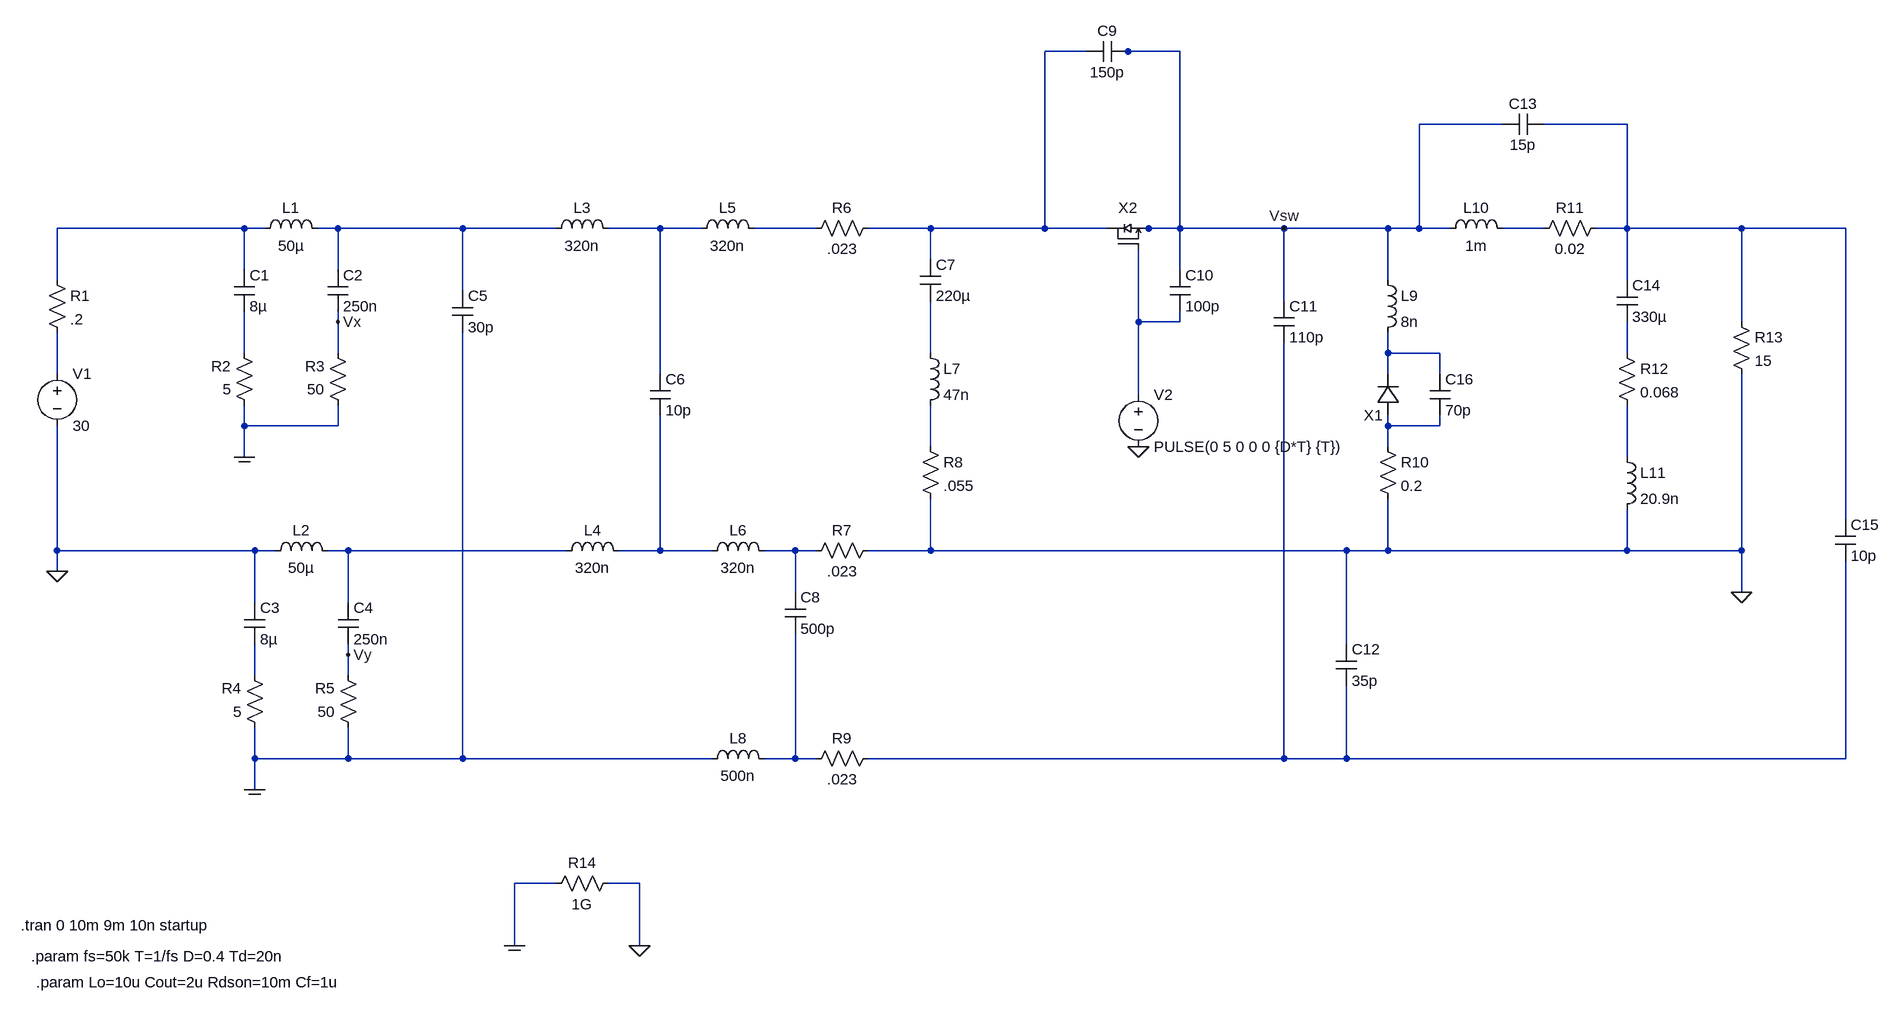
[diagram p0: schematic Buck_EMI.asc]
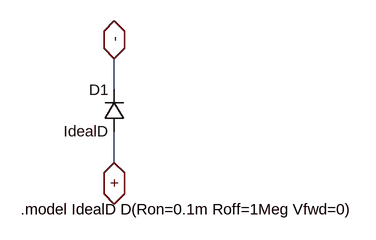
[diagram p1: sub-circuit idealdiode.asc]
Buck_EMI.asc, the LTspice schematic file:
Version 4
SHEET 1 1928 1192
WIRE 704 -256 640 -256
WIRE 768 -256 752 -256
WIRE 848 -256 768 -256
WIRE 1344 -144 1216 -144
WIRE 1536 -144 1408 -144
WIRE -592 16 -880 16
WIRE -560 16 -592 16
WIRE -448 16 -480 16
WIRE -256 16 -448 16
WIRE -112 16 -256 16
WIRE 48 16 -32 16
WIRE 112 16 48 16
WIRE 288 16 192 16
WIRE 464 16 368 16
WIRE 640 16 640 -256
WIRE 640 16 464 16
WIRE 736 16 640 16
WIRE 800 16 784 16
WIRE 848 16 848 -256
WIRE 848 16 800 16
WIRE 1008 16 848 16
WIRE 1168 16 1008 16
WIRE 1216 16 1216 -144
WIRE 1216 16 1168 16
WIRE 1264 16 1216 16
WIRE 1408 16 1344 16
WIRE 1536 16 1536 -144
WIRE 1536 16 1488 16
WIRE 1712 16 1536 16
WIRE 1872 16 1712 16
WIRE 464 64 464 16
WIRE -592 80 -592 16
WIRE -448 80 -448 16
WIRE 848 80 848 16
WIRE -880 96 -880 16
WIRE 1168 96 1168 16
WIRE 1536 96 1536 16
WIRE -256 112 -256 16
WIRE 1008 128 1008 16
WIRE -448 160 -448 144
WIRE 784 160 784 48
WIRE 848 160 848 144
WIRE 848 160 784 160
WIRE 1712 160 1712 16
WIRE -592 208 -592 144
WIRE -448 208 -448 160
WIRE 464 208 464 128
WIRE 1168 208 1168 176
WIRE 1248 208 1168 208
WIRE 1536 208 1536 160
WIRE -880 240 -880 176
WIRE 48 240 48 16
WIRE 1168 240 1168 208
WIRE 1248 240 1248 208
WIRE 784 272 784 160
WIRE -592 320 -592 288
WIRE -448 320 -448 288
WIRE -448 320 -592 320
WIRE 1168 320 1168 304
WIRE 1248 320 1248 304
WIRE 1248 320 1168 320
WIRE 464 352 464 288
WIRE 1168 352 1168 320
WIRE -592 368 -592 320
WIRE 1536 368 1536 288
WIRE 1872 464 1872 16
WIRE -880 512 -880 320
WIRE -576 512 -880 512
WIRE -544 512 -576 512
WIRE -432 512 -464 512
WIRE -96 512 -432 512
WIRE 48 512 48 304
WIRE 48 512 -16 512
WIRE 128 512 48 512
WIRE 256 512 208 512
WIRE 288 512 256 512
WIRE 464 512 464 432
WIRE 464 512 368 512
WIRE 1104 512 464 512
WIRE 1168 512 1168 432
WIRE 1168 512 1104 512
WIRE 1536 512 1536 448
WIRE 1536 512 1168 512
WIRE 1712 512 1712 240
WIRE 1712 512 1536 512
WIRE -880 544 -880 512
WIRE 256 576 256 512
WIRE 1712 576 1712 512
WIRE -576 592 -576 512
WIRE -432 592 -432 512
WIRE 1104 656 1104 512
WIRE -432 672 -432 656
WIRE -576 704 -576 656
WIRE -432 704 -432 672
WIRE -576 832 -576 784
WIRE -432 832 -432 784
WIRE -432 832 -576 832
WIRE -256 832 -256 176
WIRE -256 832 -432 832
WIRE 128 832 -256 832
WIRE 256 832 256 640
WIRE 256 832 208 832
WIRE 288 832 256 832
WIRE 1008 832 1008 192
WIRE 1008 832 368 832
WIRE 1104 832 1104 720
WIRE 1104 832 1008 832
WIRE 1872 832 1872 528
WIRE 1872 832 1104 832
WIRE -576 880 -576 832
WIRE -112 1024 -176 1024
WIRE 16 1024 -32 1024
WIRE -176 1120 -176 1024
WIRE 16 1120 16 1024
FLAG -592 368 COM
FLAG -576 880 COM
FLAG -448 160 Vx
FLAG -432 672 Vy
FLAG -880 544 0
FLAG -176 1120 COM
FLAG 16 1120 0
FLAG 1008 16 Vsw
FLAG 784 352 0
FLAG 1712 576 0
DATAFLAG 1536 -32 ""
DATAFLAG 1552 16 ""
DATAFLAG -880 16 ""
SYMBOL voltage -880 224 R0
WINDOW 123 0 0 Left 0
WINDOW 39 0 0 Left 0
SYMATTR InstName V1
SYMATTR Value 30
SYMBOL res -896 80 R0
SYMATTR InstName R1
SYMATTR Value .2
SYMBOL res -576 304 R180
WINDOW 0 36 76 Left 2
WINDOW 3 36 40 Left 2
SYMATTR InstName R2
SYMATTR Value 5
SYMBOL res -432 304 R180
WINDOW 0 36 76 Left 2
WINDOW 3 36 40 Left 2
SYMATTR InstName R3
SYMATTR Value 50
SYMBOL res -560 800 R180
WINDOW 0 36 76 Left 2
WINDOW 3 36 40 Left 2
SYMATTR InstName R4
SYMATTR Value 5
SYMBOL res -416 800 R180
WINDOW 0 36 76 Left 2
WINDOW 3 36 40 Left 2
SYMATTR InstName R5
SYMATTR Value 50
SYMBOL ind -576 32 R270
WINDOW 0 32 56 VTop 2
WINDOW 3 5 56 VBottom 2
SYMATTR InstName L1
SYMATTR Value 50µ
SYMBOL ind -560 528 R270
WINDOW 0 32 56 VTop 2
WINDOW 3 5 56 VBottom 2
SYMATTR InstName L2
SYMATTR Value 50µ
SYMBOL cap -608 80 R0
SYMATTR InstName C1
SYMATTR Value 8µ
SYMBOL cap -464 80 R0
SYMATTR InstName C2
SYMATTR Value 250n
SYMBOL cap -592 592 R0
SYMATTR InstName C3
SYMATTR Value 8µ
SYMBOL cap -448 592 R0
SYMATTR InstName C4
SYMATTR Value 250n
SYMBOL ind -128 32 R270
WINDOW 0 32 56 VTop 2
WINDOW 3 5 56 VBottom 2
SYMATTR InstName L3
SYMATTR Value 320n
SYMBOL ind -112 528 R270
WINDOW 0 32 56 VTop 2
WINDOW 3 5 56 VBottom 2
SYMATTR InstName L4
SYMATTR Value 320n
SYMBOL cap -272 112 R0
SYMATTR InstName C5
SYMATTR Value 30p
SYMBOL cap 32 240 R0
SYMATTR InstName C6
SYMATTR Value 10p
SYMBOL ind 96 32 R270
WINDOW 0 32 56 VTop 2
WINDOW 3 5 56 VBottom 2
SYMATTR InstName L5
SYMATTR Value 320n
SYMBOL ind 112 528 R270
WINDOW 0 32 56 VTop 2
WINDOW 3 5 56 VBottom 2
SYMATTR InstName L6
SYMATTR Value 320n
SYMBOL res 384 0 R90
WINDOW 0 0 56 VBottom 2
WINDOW 3 32 56 VTop 2
SYMATTR InstName R6
SYMATTR Value .023
SYMBOL res 384 496 R90
WINDOW 0 0 56 VBottom 2
WINDOW 3 32 56 VTop 2
SYMATTR InstName R7
SYMATTR Value .023
SYMBOL cap 448 64 R0
SYMATTR InstName C7
SYMATTR Value 220µ
SYMBOL ind 448 192 R0
SYMATTR InstName L7
SYMATTR Value 47n
SYMBOL res 448 336 R0
SYMATTR InstName R8
SYMATTR Value .055
SYMBOL cap 240 576 R0
SYMATTR InstName C8
SYMATTR Value 500p
SYMBOL ind 112 848 R270
WINDOW 0 32 56 VTop 2
WINDOW 3 5 56 VBottom 2
SYMATTR InstName L8
SYMATTR Value 500n
SYMBOL res 384 816 R90
WINDOW 0 0 56 VBottom 2
WINDOW 3 32 56 VTop 2
SYMATTR InstName R9
SYMATTR Value .023
SYMBOL cap 768 -272 R90
WINDOW 0 0 32 VBottom 2
WINDOW 3 32 32 VTop 2
SYMATTR InstName C9
SYMATTR Value 150p
SYMBOL cap 832 80 R0
SYMATTR InstName C10
SYMATTR Value 100p
SYMBOL cap 992 128 R0
SYMATTR InstName C11
SYMATTR Value 110p
SYMBOL cap 1088 656 R0
SYMATTR InstName C12
SYMATTR Value 35p
SYMBOL ind 1152 80 R0
SYMATTR InstName L9
SYMATTR Value 8n
SYMBOL res 1152 336 R0
SYMATTR InstName R10
SYMATTR Value 0.2
SYMBOL ind 1248 32 R270
WINDOW 0 32 56 VTop 2
WINDOW 3 5 56 VBottom 2
SYMATTR InstName L10
SYMATTR Value 1m
SYMBOL res 1504 0 R90
WINDOW 0 0 56 VBottom 2
WINDOW 3 32 56 VTop 2
SYMATTR InstName R11
SYMATTR Value 0.02
SYMBOL cap 1344 -128 R270
WINDOW 0 32 32 VTop 2
WINDOW 3 0 32 VBottom 2
SYMATTR InstName C13
SYMATTR Value 15p
SYMBOL cap 1520 96 R0
SYMATTR InstName C14
SYMATTR Value 330µ
SYMBOL res 1520 192 R0
SYMATTR InstName R12
SYMATTR Value 0.068
SYMBOL ind 1520 352 R0
SYMATTR InstName L11
SYMATTR Value 20.9n
SYMBOL res 1696 144 R0
SYMATTR InstName R13
SYMATTR Value 15
SYMBOL cap 1856 464 R0
SYMATTR InstName C15
SYMATTR Value 10p
SYMBOL cap 1232 240 R0
SYMATTR InstName C16
SYMATTR Value 70p
SYMBOL voltage 784 256 R0
WINDOW 123 0 0 Left 0
WINDOW 39 0 0 Left 0
SYMATTR InstName V2
SYMATTR Value PULSE(0 5 0 0 0 {D*T} {T})
SYMBOL IdealDiode 1184 304 R180
SYMATTR InstName X1
SYMBOL IdealSW 768 32 R0
SYMATTR InstName X2
SYMBOL res -16 1008 R90
WINDOW 0 0 56 VBottom 2
WINDOW 3 32 56 VTop 2
SYMATTR InstName R14
SYMATTR Value 1G
TEXT -936 1088 Left 2 !.tran 0 10m 9m 10n startup
TEXT -920 1136 Left 2 !.param fs=50k T=1/fs D=0.4 Td=20n
TEXT -912 1176 Left 2 !.param Lo=10u Cout=2u Rdson=10m Cf=1u

idealdiode.asc, the sub-circuit schematic file:
Version 4
SHEET 1 880 680
WIRE 336 144 336 96
WIRE 336 256 336 208
FLAG 336 96 -
IOPIN 336 96 BiDir
FLAG 336 256 +
IOPIN 336 256 BiDir
SYMBOL diode 352 208 R180
WINDOW 0 24 64 Left 2
WINDOW 3 24 0 Left 2
SYMATTR InstName D1
SYMATTR Value IdealD
TEXT 192 328 Left 2 !.model IdealD D(Ron=0.1m Roff=1Meg Vfwd=0)

The netlist it stands for:
* Buck_EMI.asc
V1 N013 0 30
R1 N003 N013 .2
R2 COM N009 5
R3 COM Vx 50
R4 COM N020 5
R5 COM Vy 50
L1 N003 N004 50µ
L2 0 N017 50µ
C1 N003 N009 8µ
C2 N004 Vx 250n
C3 0 N020 8µ
C4 N017 Vy 250n
L3 N004 N005 320n
L4 N017 N018 320n
C5 N004 COM 30p
C6 N005 N018 10p
L5 N005 N006 320n
L6 N018 N019 320n
R6 N001 N006 .023
R7 0 N019 .023
C7 N001 N010 220µ
L7 N010 N015 47n
R8 N015 0 .055
C8 N019 N021 500p
L8 COM N021 500n
R9 N022 N021 .023
C9 Vsw N001 150p
C10 Vsw N008 100p
C11 Vsw N022 110p
C12 0 N022 35p
L9 Vsw N011 8n
R10 N014 0 0.2
L10 Vsw N007 1m
R11 N002 N007 0.02
C13 Vsw N002 15p
C14 N002 N012 330µ
R12 N012 N016 0.068
L11 N016 0 20.9n
R13 N002 0 15
C15 N002 N022 10p
C16 N011 N014 70p
V2 N008 0 PULSE(0 5 0 0 0 {D*T} {T})
XX1 N014 N011 idealdiode
XX2 N001 N008 Vsw IdealSW  ; pins D G S
R14 0 COM 1G

* block symbol definitions
.subckt idealdiode + -
D1 + - IdealD
.model IdealD D(Ron=0.1m Roff=1Meg Vfwd=0)
.ends idealdiode

.model D D
.lib standard.dio
.tran 0 10m 9m 10n startup
.param fs=50k T=1/fs D=0.4 Td=20n
.param Lo=10u Cout=2u Rdson=10m Cf=1u
.backanno
.end